# Altium schematic sheet 原理图.SchDoc
size A4
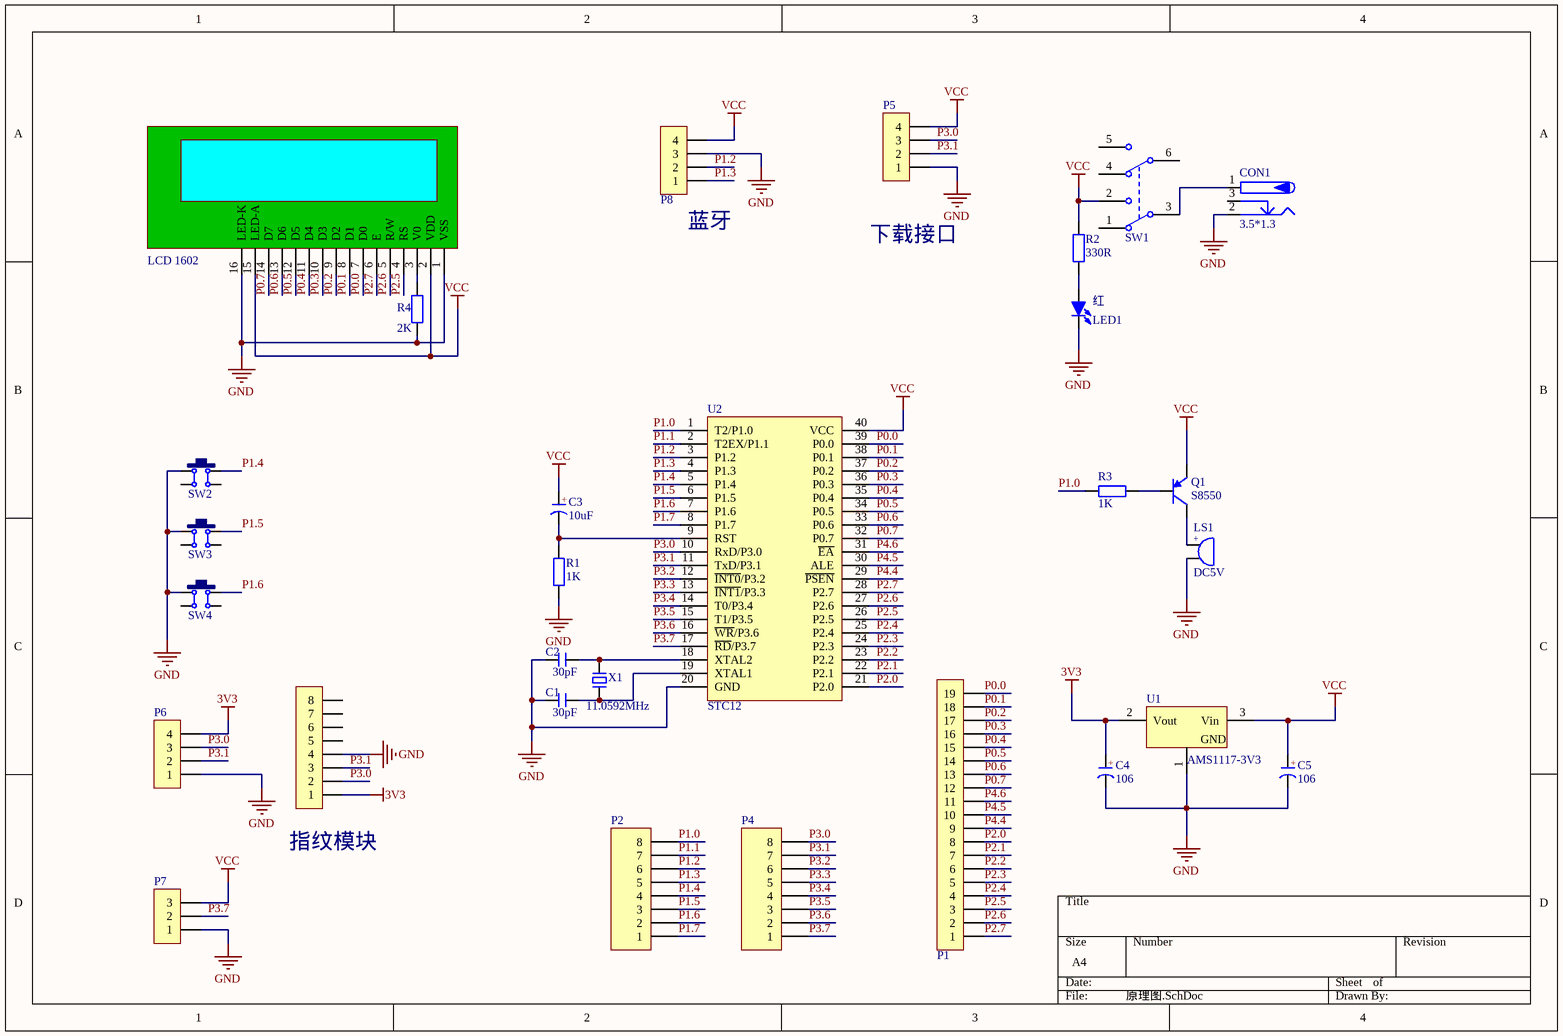
[diagram p0: 原理图.SchDoc]

## Parts
?  HDR-1X8  [MX 1.25-WI-8P]  (value not drawn)
C1  30pF  [CC 2.2*5]
C2  30pF  [CC 2.2*5]
C3  10uF  [CAP 2.5*5*11]
C4  106  [C 0805_M]
C5  106  [C 0805_M]
CON1  3.5*1.3  [DC-002]
LCD1  LCD 1602  [LCD-1602]
LED1  红  [LED 5MM-B]
LS1  DC5V  [BEEP 7.6x12x7.5]
P1  HDR-1X19  [HDR2.54-LI-19P]  (value not drawn)
P2  Header 8  [HDR2.54-LI-8P]  (value not drawn)
P4  Header 8  [HDR2.54-LI-8P]  (value not drawn)
P5  HDR-1X4  [HDR2.54-LI-4P]  (value not drawn)
P6  HDR-1X4  [HDR2.54-WI-4P]  (value not drawn)
P7  HDR-1X3  [HDR2.54-WI-3P]  (value not drawn)
P8  HDR-1X4  [HDR2.54-LI-4P]  (value not drawn)
Q1  S8550  [TO92A]
R1  1K  [RS 1/4W]
R2  330R  [RS 1/4W]
R3  1K  [RS 1/4W]
R4  2K  [RS 1/4W]
SW1  KET 8X8  [KFT DIP-8X8]  (value not drawn)
SW2  6x6x5  [TSW DIP-6*6*5]  (value not drawn)
SW3  6x6x5  [TSW DIP-6*6*5]  (value not drawn)
SW4  6x6x5  [TSW DIP-6*6*5]  (value not drawn)
U1  AMS1117-3V3  [SOT223_L]
U2  STC12  [DIP40-600_MH]
X1  11.0592MHz  [OSC HC-49S]

## Nets
3V3: ?.1 C4.1(A) P6.4 U1.2(Vout)
GND: ?.4 C1.1 C2.1 C4.2(K) C5.2(K) CON1.2 LCD1.1(VSS) LCD1.16(LED-K) LED1.2(K) LS1.2 P5.1 P6.1 P7.1 P8.3 R1.2 R4.1 SW2.1 SW3.1 SW4.1 U1.1(GND) U2.20(GND)
VCC: C3.1(A) C5.1(A) LCD1.2(VDD) LCD1.15(LED-A) P5.4 P7.3 P8.4 Q1.1(E) R2.2 SW1.2(COM2) U1.3(Vin) U2.40(VCC)
P0.0: LCD1.7(D0) P1.19 U2.39(P0.0)
P0.1: LCD1.8(D1) P1.18 U2.38(P0.1)
P0.2: LCD1.9(D2) P1.17 U2.37(P0.2)
P0.3: LCD1.10(D3) P1.16 U2.36(P0.3)
P0.4: LCD1.11(D4) P1.15 U2.35(P0.4)
P0.5: LCD1.12(D5) P1.14 U2.34(P0.5)
P0.6: LCD1.13(D6) P1.13 U2.33(P0.6)
P0.7: LCD1.14(D7) P1.12 U2.32(P0.7)
P1.0: P2.8 R3.1 U2.1(T2/P1.0)
P1.1: P2.7 U2.2(T2EX/P1.1)
P1.2: P2.6 P8.2 U2.3(P1.2)
P1.3: P2.5 P8.1 U2.4(P1.3)
P1.4: P2.4 SW2.2 U2.5(P1.4)
P1.5: P2.3 SW3.2 U2.6(P1.5)
P1.6: P2.2 SW4.2 U2.7(P1.6)
P1.7: P2.1 U2.8(P1.7)
P2.0: P1.8 U2.21(P2.0)
P2.1: P1.7 U2.22(P2.1)
P2.2: P1.6 U2.23(P2.2)
P2.3: P1.5 U2.24(P2.3)
P2.4: P1.4 U2.25(P2.4)
P2.5: LCD1.4(RS) P1.3 U2.26(P2.5)
P2.6: LCD1.5(R/W) P1.2 U2.27(P2.6)
P2.7: LCD1.6(E) P1.1 U2.28(P2.7)
P3.0: ?.2 P4.8 P5.3 P6.3 U2.10(RxD/P3.0)
P3.1: ?.3 P4.7 P5.2 P6.2 U2.11(TxD/P3.1)
P3.2: P4.6 U2.12(~{INT0}/P3.2)
P3.3: P4.5 U2.13(~{INT1}/P3.3)
P3.4: P4.4 U2.14(T0/P3.4)
P3.5: P4.3 U2.15(T1/P3.5)
P3.6: P4.2 U2.16(~{WR}/P3.6)
P3.7: P4.1 P7.2 U2.17(~{RD}/P3.7)
P4.4: P1.9 U2.29(~{PSEN})
P4.5: P1.10 U2.30(ALE)
P4.6: P1.11 U2.31(~{EA})
NetC1_2: C1.2 U2.19(XTAL1) X1.2
NetC2_2: C2.2 U2.18(XTAL2) X1.1
NetC3_2: C3.2(K) R1.1 U2.9(RST)
NetCON1_1: CON1.1 SW1.3(NO1)
NetLCD1_3: LCD1.3(V0) R4.2
NetLED1_1: LED1.1(A) R2.1
NetLS1_1: LS1.1 Q1.3(C)
NetQ1_2: Q1.2(B) R3.2

Not connected (* = marked no-connect by the designer): ? 5 6 7 8; CON1 3; SW1 1(NC1) 4(NO2) 5(COM2) 6(NC2); SW2 3 4; SW3 3 4; SW4 3 4

## Notes on the sheet
- (near P8) 蓝牙
- 下载接口
- 指纹模块
- (in symbol BEEP) +
- (in symbol C-CAP) +
- (in symbol C-CD) +

## Library data of the parts
? = Header 8: 8P接插件; 版权归属: 源创客; BOM名称: 8P接插件; 学习资源: www.ooocke.com
C1 C2 = C-CC: 直插瓷片电容; 版权归属: 源创客; BOM名称: 直插瓷片电容; 学习资源: www.ooocke.com
C3 = C-CAP: 直插电解电容; 版权归属: 源创客; BOM名称: 直插电解电容; 学习资源: www.ooocke.com
C4 C5 = C-CD: 贴片钽电容; 版权归属: 源创客; BOM名称: 贴片钽电容; 学习资源: www.ooocke.com
CON1 = P-DC: 低压电源接口; BOM名称: DC电源接口; 版权归属: 源创客; 学习资源: www.ooocke.com
LCD1 = LCD 1602: 版权归属: 源创客; BOM名称: LCD 1602; 学习资源: www.ooocke.com
LED1 = LED-5MM: 5mm插件LED; 版权归属: 源创客; BOM名称: 5mm插件LED; 学习资源: www.ooocke.com
LS1 = BEEP: 蜂鸣器; 版权归属: 源创客; BOM名称: 蜂鸣器; 学习资源: www.ooocke.com
P1 = Header 19: 19P接插件; 版权归属: 源创客; BOM名称: 19P接插件; 学习资源: www.ooocke.com
P2 P4 = Header 8: Header, 8-Pin; LatestRevisionDate: 17-Jul-2002; LatestRevisionNote: Re-released for DXP Platform.; Publisher: Altium Limited
P5 P6 P8 = Header 4: 4P接插件; 版权归属: 源创客; BOM名称: 4P接插件; 学习资源: www.ooocke.com
P7 = Header 3: 3P接插件; 版权归属: 源创客; BOM名称: 3P接插件; 学习资源: www.ooocke.com
Q1 = 8550-DIP: 高频放大-PNP型; 版权归属: 源创客; 属性: 40V 1.5A 1W 100MHZ; BOM名称: 高频放大-PNP型; 学习资源: www.ooocke.com
R1-R4 = R-CRR: 直插色环电阻; BOM名称: 色环电阻; 版权归属: 源创客; 学习资源: www.ooocke.com
SW1 = KET 8X8: 8*8自锁开关; 版权归属: 源创客; BOM名称: 8*8自锁开关; 学习资源: www.ooocke.com
SW2-SW4 = TSW DIP-6x6: 直插6x6轻触开关; 版权归属: 源创客; BOM名称: 直插6x6轻触开关; 学习资源: www.ooocke.com
U1 = AMS1117: 三端稳压芯片; BOM名称: 稳压芯片; 版权归属: 源创客; 学习资源: www.ooocke.com
U2 = STC89C5xx: STC单片机; 版权归属: 源创客; BOM名称: STC单片机; 学习资源: www.ooocke.com
X1 = XTAL-2P: 2脚无源脚晶振; 版权归属: 源创客; BOM名称: 2脚无源脚晶振; 学习资源: www.ooocke.com